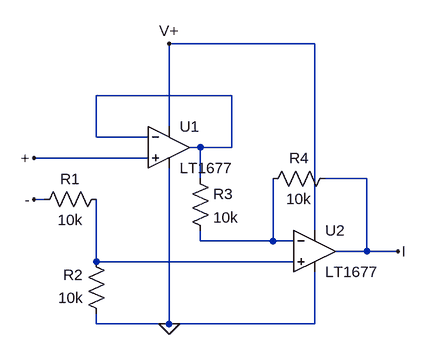
[diagram p0: schematic Isense.asc]
Isense.asc, the LTspice schematic file:
Version 4
SHEET 1 880 680
WIRE 416 -64 192 -64
WIRE 288 16 80 16
WIRE 192 64 192 -64
WIRE 80 80 80 16
WIRE 160 80 80 80
WIRE 240 96 224 96
WIRE 288 96 288 16
WIRE 288 96 240 96
WIRE 160 112 -16 112
WIRE 240 144 240 96
WIRE 496 144 432 144
WIRE 0 176 -16 176
WIRE 416 224 416 -64
WIRE 240 240 240 224
WIRE 352 240 352 144
WIRE 352 240 240 240
WIRE 384 240 352 240
WIRE 496 256 496 144
WIRE 496 256 448 256
WIRE 544 256 496 256
WIRE 80 272 80 176
WIRE 384 272 80 272
WIRE 80 368 80 352
WIRE 192 368 192 128
WIRE 192 368 80 368
WIRE 416 368 416 288
WIRE 416 368 192 368
FLAG -16 112 +
FLAG -16 176 -
FLAG 544 256 I
FLAG 192 368 0
FLAG 192 -64 V+
SYMBOL Opamps\\LT1677 192 32 R0
SYMATTR InstName U1
SYMBOL Opamps\\LT1677 416 192 R0
SYMATTR InstName U2
SYMBOL res 96 160 R90
WINDOW 0 0 56 VBottom 2
WINDOW 3 32 56 VTop 2
SYMATTR InstName R1
SYMATTR Value 10k
SYMBOL res 96 368 R180
WINDOW 0 36 76 Left 2
WINDOW 3 36 40 Left 2
SYMATTR InstName R2
SYMATTR Value 10k
SYMBOL res 224 128 R0
SYMATTR InstName R3
SYMATTR Value 10k
SYMBOL res 448 128 R90
WINDOW 0 0 56 VBottom 2
WINDOW 3 32 56 VTop 2
SYMATTR InstName R4
SYMATTR Value 10k

The netlist it stands for:
* Isense.asc
XU1 + N001 V+ 0 N001 LT1677  ; pins In+ In- V+ V- OUT
XU2 N003 N002 V+ 0 I LT1677  ; pins In+ In- V+ V- OUT
R1 N003 - 10k
R2 0 N003 10k
R3 N001 N002 10k
R4 I N002 10k
.lib LTC.lib
.backanno
.end